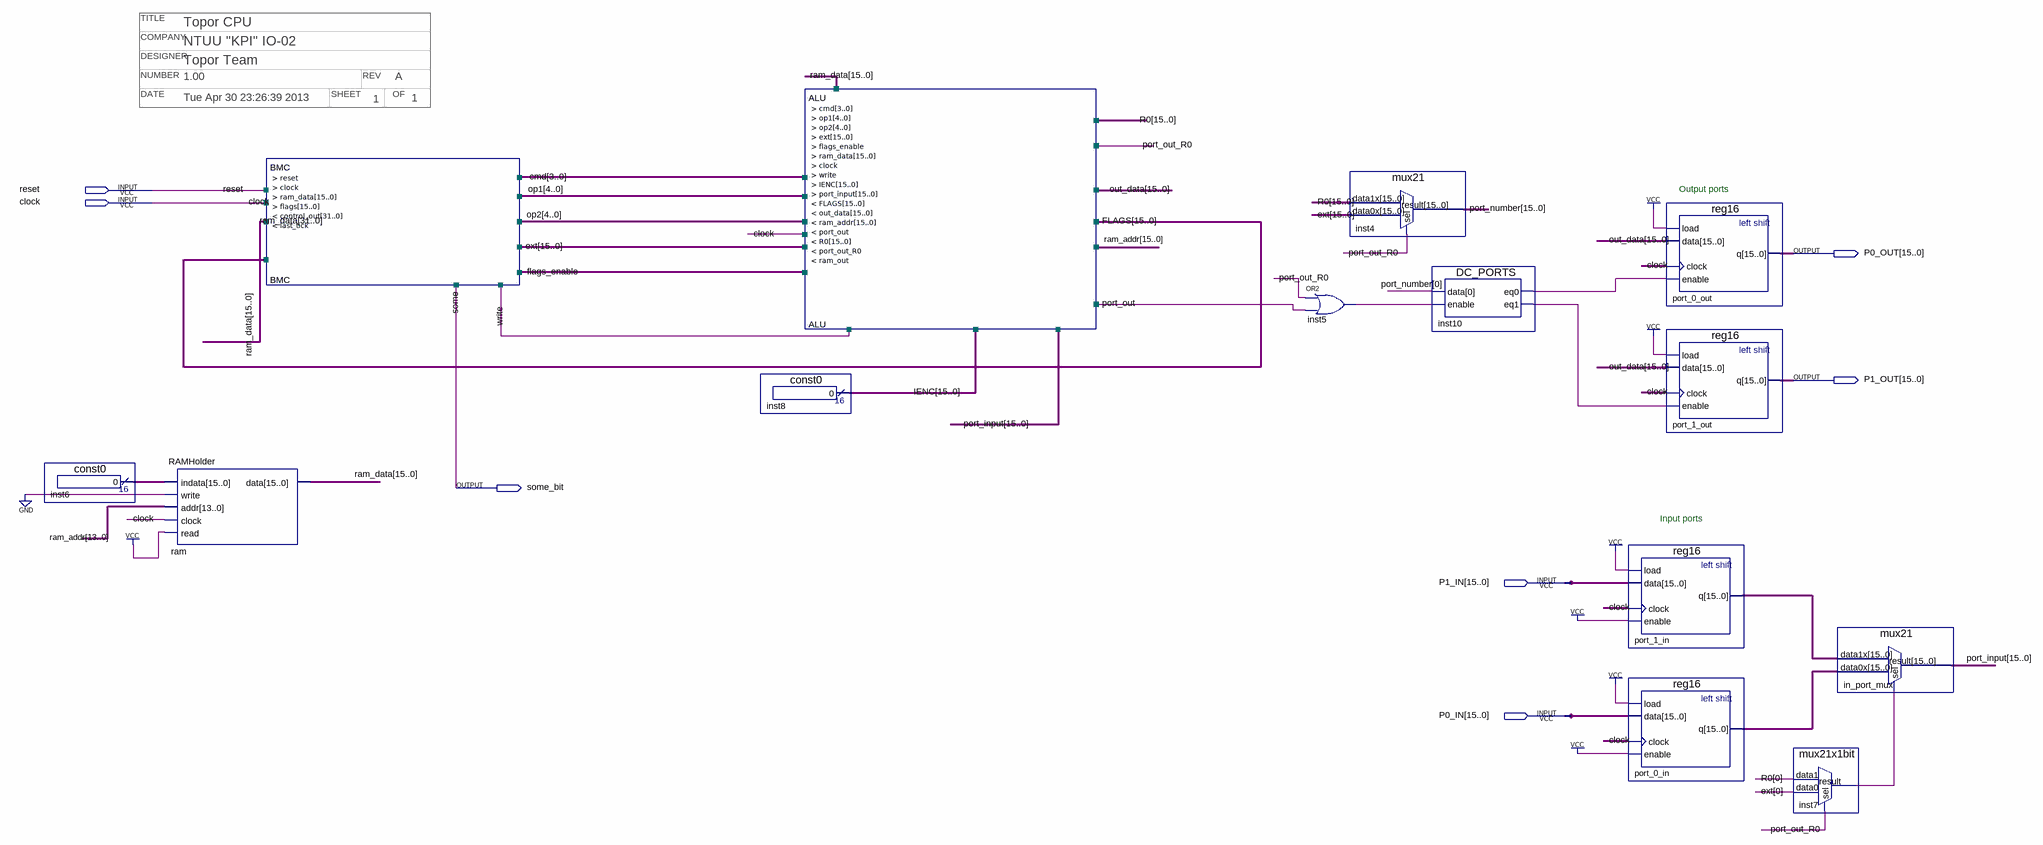
[diagram p0: schematic sheet]
// Quartus schematic CPU.bdf as structural Verilog: 14 symbols, 7 pins
// Title block: TITLE: Topor CPU; COMPANY: NTUU "KPI" IO-02; DESIGNER: Topor Team; NUMBER: 1.00; REV: A; DATE: Tue Apr 30 23:26:39 2013; SHEET: 1; OF: 1
module CPU (
  input  reset,
  input  clock,
  input  [15:0] P1_IN,
  input  [15:0] P0_IN,
  output [15:0] P0_OUT,
  output [15:0] P1_OUT,
  output some_bit
);

  wire flags_enable, inst5_out, inst7_result, inst10_eq0, inst10_eq1, port_out, port_out_R0, write;
  wire [3:0] cmd;
  wire [4:0] op1, op2;
  wire [15:0] ext, FLAGS, IENC, inst6_result, out_data, port_0_in_q, port_1_in_q, port_input, port_number,
       R0, ram_addr, ram_data;

  const0 inst6 (.result(inst6_result));
  RAMHolder ram (
    .indata(inst6_result), .write(1'b0), .addr(ram_addr[13:0]), .clock(clock), .read(1'b1), .data(ram_data));
  BMC BMC (.reset(reset), .clock(clock), .ram_data(ram_data), .flags(FLAGS), .last_tick(write));  // open: control_out
  const0 inst8 (.result(IENC));
  ALU ALU (
    .cmd(cmd), .op1(op1), .op2(op2), .ext(ext), .flags_enable(flags_enable), .ram_data(ram_data),
    .clock(clock), .write(write), .IENC(IENC), .port_input(port_input), .FLAGS(FLAGS), .out_data(out_data),
    .ram_addr(ram_addr), .port_out(port_out), .R0(R0), .port_out_R0(port_out_R0));  // open: ram_out
  mux21 inst4 (.data1x(R0), .data0x(ext), .sel(port_out_R0), .result(port_number));
  or inst5 (inst5_out, port_out_R0, port_out);
  DC_PORTS inst10 (.data(port_number[0]), .enable(inst5_out), .eq0(inst10_eq0), .eq1(inst10_eq1));
  reg16 port_1_in (.load(1'b1), .data(P1_IN), .clock(clock), .enable(1'b1), .q(port_1_in_q));
  reg16 port_0_in (.load(1'b1), .data(P0_IN), .clock(clock), .enable(1'b1), .q(port_0_in_q));
  reg16 port_0_out (.load(1'b1), .data(out_data), .clock(clock), .enable(inst10_eq0), .q(P0_OUT));
  reg16 port_1_out (.load(1'b1), .data(out_data), .clock(clock), .enable(inst10_eq1), .q(P1_OUT));
  mux21x1bit inst7 (.data1(R0[0]), .data0(ext[0]), .sel(port_out_R0), .result(inst7_result));
  mux21 in_port_mux (.data1x(port_1_in_q), .data0x(port_0_in_q), .sel(inst7_result), .result(port_input));

  // Other names for the same wires on the sheet: some = some_bit

  // Notes on the sheet:
  //   Output ports
  //   Input ports
endmodule
